# EAGLE schematic rabbit_base_ (EAGLE 4.16)
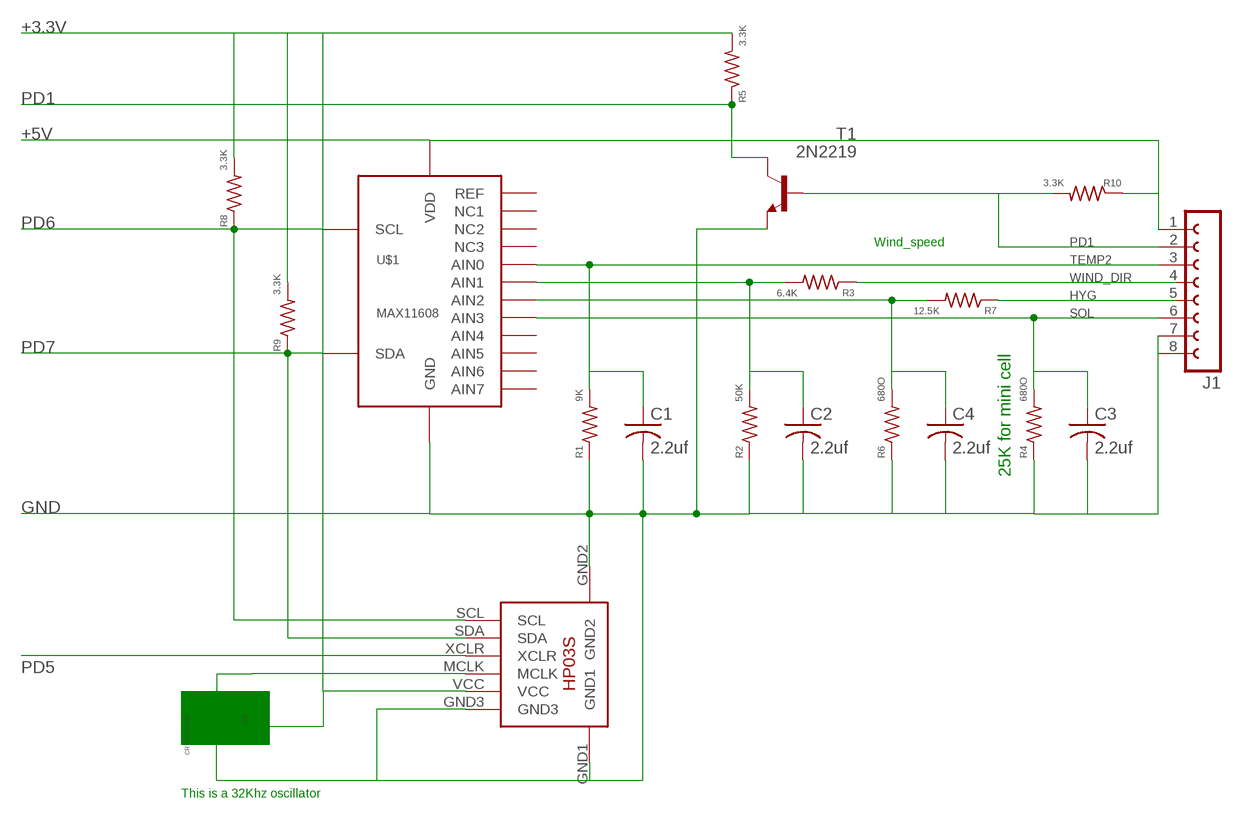
[diagram p0: schematic, sheet 1]

## Parts
C1  2.2uf  C-USC1310  [C1310]
C2  2.2uf  C-USC1310  [C1310]
C3  2.2uf  C-USC1310  [C1310]
C4  2.2uf  C-USC1310  [C1310]
J1  FE08-150_MIL_PITCH  [HEADER_8_50]
R1  9K  R-US_M0805  [M0805]
R2  50K  R-US_M0805  [M0805]
R3  6.4K  R-US_M0805  [M0805]
R4  680O  R-US_M0805  [M0805]
R5  3.3K  R-US_M0805  [M0805]
R6  680O  R-US_M0805  [M0805]
R7  12.5K  R-US_M0805  [M0805]
R8  3.3K  R-US_M0805  [M0805]
R9  3.3K  R-US_M0805  [M0805]
R10  3.3K  R-US_M0805  [M0805]
T1  2N2219  [TO5]
U$1  MAX11608  [QSOP_16]
U$2  CRYSTALSMD  [CRYSTAL3.2X2.5]
U$4  HP03S  [HP03S]

## Nets
+3.3V: R5.2 R8.2 R9.2 U$4.VCC
+5V: J1.1 R10.1 U$1.P$16(VDD)
GND: C1.2 C2.2 C3.2 C4.2 J1.7 J1.8 R1.1 R2.1 R4.1 R6.1 T1.1(E) U$1.P$15(GND) U$4.GND1 U$4.GND2 U$4.GND3
HYG: R7.1
N$2: C2.1 R2.2 R3.2 U$1.P$6(AIN1)
N$3: U$4.MCLK
N$4: J1.2 R10.2 T1.2(B)
N$5: C4.1 R6.2 R7.2 U$1.P$7(AIN2)
PD1: R5.1 T1.3(C)
PD5: U$4.XCLR
PD6: R8.1 U$1.P$13(SCL) U$4.SCL
PD7: R9.1 U$1.P$14(SDA) U$4.SDA
SOL: C3.1 J1.6 R4.2 U$1.P$8(AIN3)
TEMP2: C1.1 J1.3 R1.2 U$1.P$5(AIN0)
WIND_DIR: R3.1
Unconnected: J1.4 J1.5 U$1.P$1(REF) U$1.P$2(NC1) U$1.P$3(NC2) U$1.P$4(NC3) U$1.P$9(AIN4) U$1.P$10(AIN5) U$1.P$11(AIN6) U$1.P$12(AIN7) U$2.IN U$2.OUT

## Notes on the sheet
- Wind_speed
- 25K for mini cell
- This is a 32Khz oscillator

## Library data of the parts
C1-C4 = rcl:C-US: CAPACITOR, American symbol
J1 = ATMEL:FE08-1: FEMALE HEADER
R1-R10 = rcl:R-US_: RESISTOR, American symbol
T1 = transistor:2N2219: NPN TRANSISTOR
U$1 = Stofer:MAX11608
U$2 = MY_ATMEL:CRYSTAL
U$4 = ATMEL:HP03S